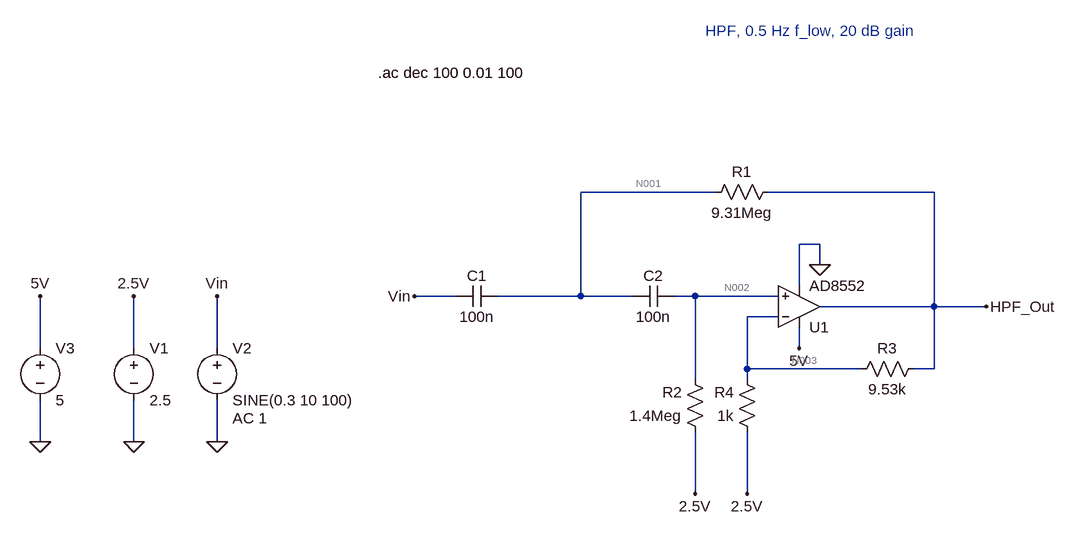
[diagram p0: schematic HPF.asc]
HPF.asc, the LTspice schematic file:
Version 4
SHEET 1 880 680
WIRE -400 32 -608 32
WIRE -64 32 -320 32
WIRE -240 112 -272 112
WIRE -240 144 -240 112
WIRE -272 176 -272 112
WIRE -800 192 -864 192
WIRE -608 192 -608 32
WIRE -608 192 -736 192
WIRE -528 192 -608 192
WIRE -432 192 -464 192
WIRE -304 192 -432 192
WIRE -64 208 -64 32
WIRE -64 208 -240 208
WIRE 16 208 -64 208
WIRE -304 224 -352 224
WIRE -1440 272 -1440 192
WIRE -1296 272 -1296 192
WIRE -1168 272 -1168 192
WIRE -272 272 -272 240
WIRE -352 304 -352 224
WIRE -176 304 -352 304
WIRE -64 304 -64 208
WIRE -64 304 -96 304
WIRE -432 320 -432 192
WIRE -352 320 -352 304
WIRE -1440 416 -1440 352
WIRE -1296 416 -1296 352
WIRE -1168 416 -1168 352
WIRE -432 496 -432 400
WIRE -352 496 -352 400
FLAG -432 496 2.5V
FLAG -352 496 2.5V
FLAG -864 192 Vin
FLAG 16 208 HPF_Out
FLAG -1296 416 0
FLAG -1296 192 2.5V
FLAG -1168 416 0
FLAG -1168 192 Vin
FLAG -240 144 0
FLAG -272 272 5V
FLAG -1440 416 0
FLAG -1440 192 5V
SYMBOL cap -736 176 R90
WINDOW 0 0 32 VBottom 2
WINDOW 3 32 32 VTop 2
SYMATTR InstName C1
SYMATTR Value 100n
SYMBOL cap -464 176 R90
WINDOW 0 0 32 VBottom 2
WINDOW 3 32 32 VTop 2
SYMATTR InstName C2
SYMATTR Value 100n
SYMBOL res -304 16 R90
WINDOW 0 0 56 VBottom 2
WINDOW 3 32 56 VTop 2
SYMATTR InstName R1
SYMATTR Value 9.31Meg
SYMBOL res -416 416 R180
WINDOW 0 36 76 Left 2
WINDOW 3 36 40 Left 2
SYMATTR InstName R2
SYMATTR Value 1.4Meg
SYMBOL res -80 288 R90
WINDOW 0 0 56 VBottom 2
WINDOW 3 32 56 VTop 2
SYMATTR InstName R3
SYMATTR Value 9.53k
SYMBOL res -336 416 R180
WINDOW 0 36 76 Left 2
WINDOW 3 36 40 Left 2
SYMATTR InstName R4
SYMATTR Value 1k
SYMBOL OpAmps\\AD8552 -272 272 M180
SYMATTR InstName U1
SYMBOL voltage -1296 256 R0
WINDOW 123 0 0 Left 0
WINDOW 39 0 0 Left 0
SYMATTR InstName V1
SYMATTR Value 2.5
SYMBOL voltage -1168 256 R0
WINDOW 123 24 124 Left 2
WINDOW 39 0 0 Left 0
SYMATTR InstName V2
SYMATTR Value SINE(0.3 10 100)
SYMATTR Value2 AC 1
SYMBOL voltage -1440 256 R0
WINDOW 123 0 0 Left 0
WINDOW 39 0 0 Left 0
SYMATTR InstName V3
SYMATTR Value 5
TEXT -920 -152 Left 2 !.ac dec 100 0.01 100
TEXT -416 -216 Left 2 ;HPF, 0.5 Hz f_low, 20 dB gain

The netlist it stands for:
* HPF.asc
C1 N001 Vin 100n
C2 N002 N001 100n
R1 HPF_Out N001 9.31Meg
R2 2.5V N002 1.4Meg
R3 HPF_Out N003 9.53k
R4 2.5V N003 1k
XU1 N002 N003 5V 0 HPF_Out AD8552  ; pins In+ In- V+ V- OUT
V1 2.5V 0 2.5
V2 Vin 0 SINE(0.3 10 100) AC 1
V3 5V 0 5
.ac dec 100 0.01 100
* HPF, 0.5 Hz f_low, 20 dB gain
.backanno
.end

* Results of the author's LTspice run, read from the files saved beside the schematic
* Operating Point, zero values left out:
*   V(n001) = 2.5 V
*   V(vin) = 300 mV
*   V(n002) = 2.5 V
*   V(hpf_out) = 2.5 V
*   V(2.5v) = 2.5 V
*   V(n003) = 2.5 V
*   V(5v) = 5 V
*   I(R4) = 2.846 nA
*   I(R3) = -2.849 nA
*   I(R2) = 2.5 pA
*   I(V3) = -740.7 µA
*   I(V1) = -2.849 nA
*   Ix(u1:1) = 2.5 pA
*   Ix(u1:2) = -2.5 pA
*   Ix(u1:99) = 740.7 µA
*   Ix(u1:50) = -740.7 µA
*   Ix(u1:45) = 2.849 nA
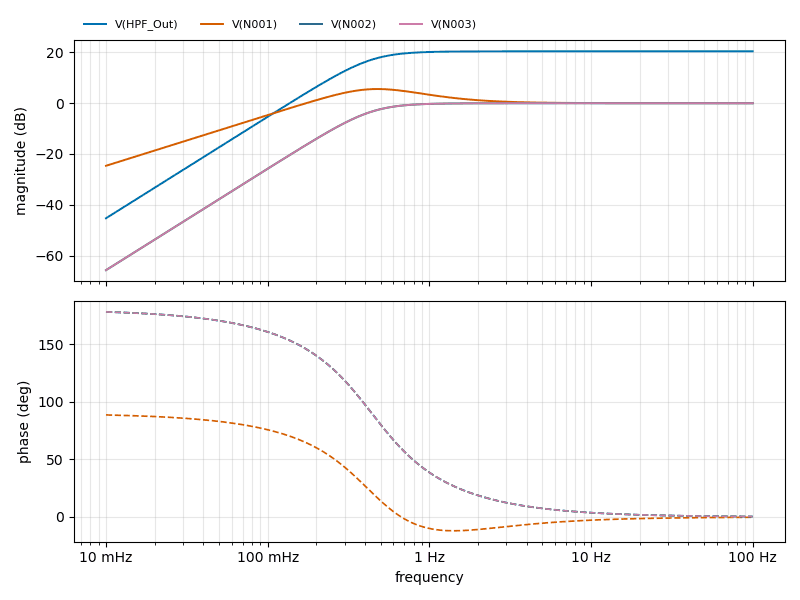
[diagram p1: AC Analysis of HPF.asc, plotted from the saved traces]
* AC Analysis, 1 run:
*   V(HPF_Out): -45.32 dB at 10 mHz, 20.45 dB at 100 Hz, peak 20.45 dB at 100 Hz, 3 dB below the peak at 456.2 mHz
*   V(N001): -24.66 dB at 10 mHz, 0.00 dB at 100 Hz, peak 5.58 dB at 478.6 mHz, 3 dB below the peak at 238.8 mHz and 1.217 Hz
*   V(N002): -65.77 dB at 10 mHz, -0.00 dB at 100 Hz, peak -0.00 dB at 100 Hz, 3 dB below the peak at 456.2 mHz
*   V(N003): -65.77 dB at 10 mHz, -0.00 dB at 100 Hz, peak -0.00 dB at 100 Hz, 3 dB below the peak at 456.2 mHz